# Altium schematic sheet NL.SchDoc
size A
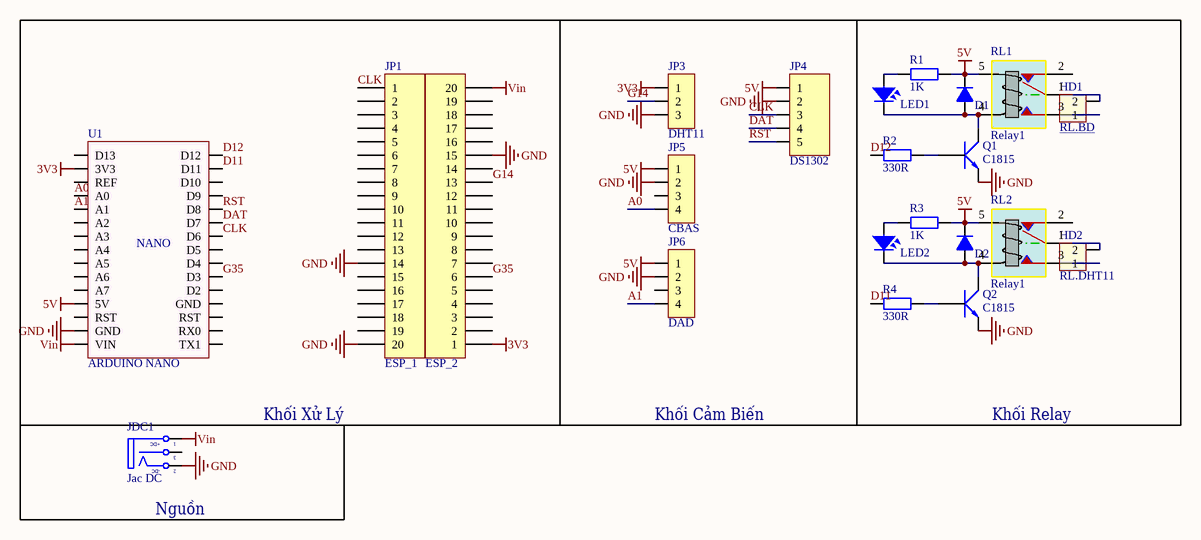
[diagram p0: NL.SchDoc]

## Parts
D1  4007  [DIODE 1A]  (value not drawn)
D2  4007  [DIODE 1A]  (value not drawn)
HD1  RL.BD  [HED2]
HD2  RL.DHT11  [HED2]
JDC1  Jac DC  [DC-IN]
JP1  ESP_1  [JP 1x20 CT]
JP2  ESP_2  [JP 1x20 CT]
JP3  DHT11  [JP 1x3 CT]
JP4  DS1302  [JP 1x5 CT]
JP5  CBAS  [JP 1x4 CT]
JP6  DAD  [JP 1x4 CT]
LED1  LED  [LED-3]  (value not drawn)
LED2  LED  [LED-3]  (value not drawn)
Q1  C1815  [TO92]
Q2  C1815  [TO92]
R1  1K  [R1/4W]
R2  330R  [R1/4W]
R3  1K  [R1/4W]
R4  330R  [R1/4W]
RL1  Relay1  [RELAY1]
RL2  Relay1  [RELAY1]
U1  ARDUINO NANO  [Arduino Nano]

## Nets
3V3: JP2.1 JP3.1 U1.3V3
5V: D1.2(K) D2.2(K) JP4.1 JP5.1 JP6.1 R1.2 R3.2 RL1.5 RL2.5 U1.5V
GND: JDC1.2(TN) JP1.14 JP1.20 JP2.15 JP3.3 JP4.2 JP5.2 JP6.2 Q1.1(E) Q2.1(E) U1.GND
Vin: JDC1.1(T) JP2.20 U1.VIN
A0: JP5.4 U1.A0
A1: JP6.4 U1.A1
CLK: JP1.1 JP4.3 U1.D6
D11: R4.1 U1.D11
D12: R2.1 U1.D12
DAT: JP4.4 U1.D7
G14: JP2.13 JP3.2
G35: JP2.6 U1.D3
RST: JP4.5 U1.D8
NetD1_1: D1.1(A) LED1.2 Q1.2(C) RL1.4
NetD2_1: D2.1(A) LED2.2 Q2.2(C) RL2.4
NetHD1_1: HD1.1 RL1.3
NetHD1_2: HD1.2 RL1.1
NetHD2_1: HD2.1 RL2.3
NetHD2_2: HD2.2 RL2.1
NetLED1_1: LED1.1 R1.1
NetLED2_1: LED2.1 R3.1
NetQ1_3: Q1.3(B) R2.2
NetQ2_3: Q2.3(B) R4.2

Not connected (* = marked no-connect by the designer): JDC1 3(S); JP1 2 3 4 5 6 7 8 9 10 11 12 13 15 16 17 18 19; JP2 2 3 4 5 7 8 9 10 11 12 14 16 17 18 19; JP5 3; JP6 3; RL1 2; RL2 2; U1 A2 A3 A4 A5 A6 A7 AGND(GND) ARST(RST) D2 D4 D5 D9 D10 D13 REF RST RX0 TX1

## Notes on the sheet
- Khối Xử Lý
- Khối Cảm Biến
- Khối Relay
- (near JDC1) Nguồn
- (in symbol ARDUINO NANO) NANO
- (in symbol DCIN) +DC; -DC

## Library data of the parts
D1 D2 = Diode 1N4007: Cắm; Ten_Linh_Kien: Diode 1N4007 1A (DIP); Don_Vi: Con; Ma_Hang: MH001063; Ghi Chu: *; Kieu_Chan: *; Chung_Loai: Cắm
HD1 HD2 = Hed2: Header 2 (Green); Value: Header 2
JDC1 = DCIN: Jac DC input; Value: Jac DC
JP1 JP2 = JP 1x20 2.54 Cai Thang: Cắm; Ten_Linh_Kien: Jump Đơn Cái 2.54MM 1x20P Thẳng; Don_Vi: Con; Ma_Hang: MH004006; Ghi_Chu: *; Kieu_Chan: *; Chung_Loai: Cắm
JP3 = JP 1x3 2.54 Cai Thang: Cắm; Ten_Linh_Kien: Jump Đơn Cái 2.54MM 1x20P Thẳng; Don_Vi: Con; Ma_Hang: MH004006; Ghi_Chu: *; Kieu_Chan: *; Chung_Loai: Cắm
JP4 = JP 1x5 2.54 Cai Thang: Cắm; Ten_Linh_Kien: Jump Đơn Cái 2.54MM 1x20P Thẳng; Don_Vi: Con; Ma_Hang: MH004006; Ghi_Chu: *; Kieu_Chan: *; Chung_Loai: Cắm
JP5 JP6 = JP 1x4 2.54 Cai Thang: Cắm; Ten_Linh_Kien: Jump Đơn Cái 2.54MM 1x20P Thẳng; Don_Vi: Con; Ma_Hang: MH004006; Ghi_Chu: *; Kieu_Chan: *; Chung_Loai: Cắm
LED1 LED2 = LED: LED Single colour Green and Red; Value: LED 3 ly Single Colour
Q1 Q2 = C1815: NPN transistor; Value: C9014
R1-R4 = R1/4W: Resistor 1/4W; Value: R1/4W - 1K
RL1 RL2 = Relay1: Relay SPDT,10A - 12VDC 5 Pin
U1 = ARDUINO NANO: ATMEGA328, ARDUINO NANO, EVAL BOARD